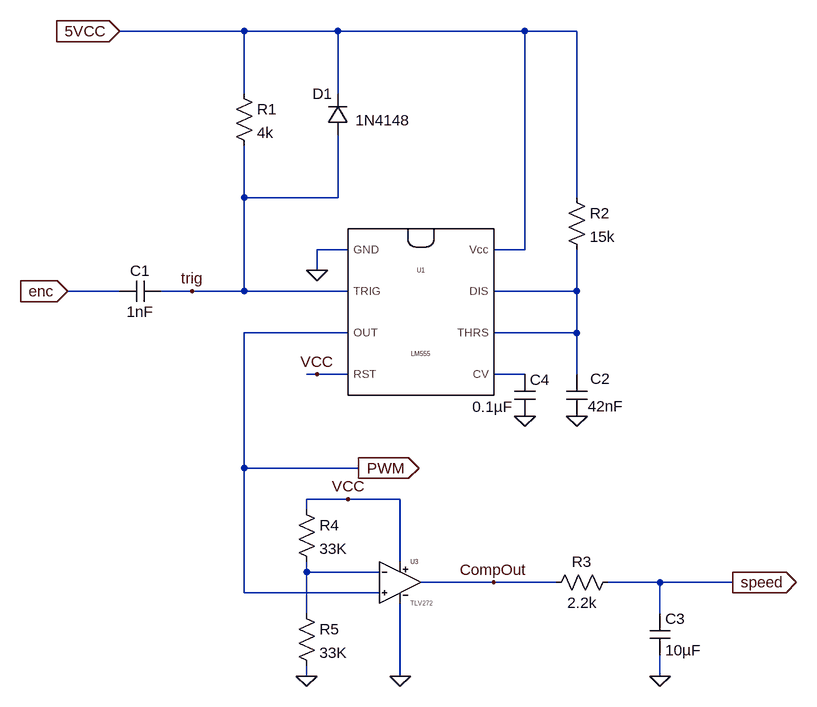
[diagram p0: schematic speedsense.asc]
speedsense.asc, the LTspice schematic file:
Version 4
SHEET 1 1592 1060
WIRE 704 -32 512 -32
WIRE 848 -32 704 -32
WIRE 1136 -32 848 -32
WIRE 1216 -32 1136 -32
WIRE 704 64 704 -32
WIRE 848 64 848 -32
WIRE 704 224 704 144
WIRE 848 224 848 128
WIRE 848 224 704 224
WIRE 1216 224 1216 -32
WIRE 864 304 816 304
WIRE 1136 304 1136 -32
WIRE 1136 304 1088 304
WIRE 816 336 816 304
WIRE 512 368 432 368
WIRE 624 368 576 368
WIRE 704 368 704 224
WIRE 704 368 624 368
WIRE 864 368 704 368
WIRE 1216 368 1216 304
WIRE 1216 368 1088 368
WIRE 864 432 704 432
WIRE 1216 432 1216 368
WIRE 1216 432 1088 432
WIRE 816 496 800 496
WIRE 864 496 816 496
WIRE 1136 496 1088 496
WIRE 1216 496 1216 432
WIRE 704 640 704 432
WIRE 880 640 704 640
WIRE 864 688 800 688
WIRE 944 688 864 688
WIRE 800 704 800 688
WIRE 944 784 944 688
WIRE 800 800 800 784
WIRE 912 800 800 800
WIRE 1088 816 976 816
WIRE 1184 816 1088 816
WIRE 1344 816 1264 816
WIRE 1456 816 1344 816
WIRE 704 832 704 640
WIRE 912 832 704 832
WIRE 800 864 800 800
WIRE 1344 864 1344 816
WIRE 800 960 800 944
WIRE 944 960 944 848
WIRE 1344 960 1344 928
FLAG 816 336 0
FLAG 1216 560 0
FLAG 1136 560 0
FLAG 1344 960 0
FLAG 512 -32 5VCC
IOPIN 512 -32 In
FLAG 816 496 VCC
FLAG 880 640 PWM
IOPIN 880 640 Out
FLAG 1456 816 speed
IOPIN 1456 816 Out
FLAG 432 368 enc
IOPIN 432 368 In
FLAG 624 368 trig
FLAG 800 960 0
FLAG 944 960 0
FLAG 864 688 VCC
FLAG 1088 816 CompOut
SYMBOL res 688 48 R0
SYMATTR InstName R1
SYMATTR Value 4k
SYMBOL diode 864 128 R180
WINDOW 0 24 64 Left 2
WINDOW 3 -96 23 Left 2
SYMATTR InstName D1
SYMATTR Value 1N4148
SYMBOL LM555 976 400 R0
SYMATTR InstName U1
SYMBOL res 1200 208 R0
SYMATTR InstName R2
SYMATTR Value 15k
SYMBOL cap 1120 496 R0
WINDOW 3 -65 50 Left 2
SYMATTR Value 0.1µF
SYMATTR InstName C4
SYMBOL res 1168 832 R270
WINDOW 0 32 56 VTop 2
WINDOW 3 0 56 VBottom 2
SYMATTR InstName R3
SYMATTR Value 2.2k
SYMBOL cap 1328 864 R0
SYMATTR InstName C3
SYMATTR Value 10µF
SYMBOL cap 512 384 R270
WINDOW 0 32 32 VTop 2
WINDOW 3 0 32 VBottom 2
SYMATTR InstName C1
SYMATTR Value 1nF
SYMBOL cap 1200 496 R0
WINDOW 0 37 7 Left 2
WINDOW 3 33 49 Left 2
SYMATTR InstName C2
SYMATTR Value 42nF
SYMBOL res 784 688 R0
SYMATTR InstName R4
SYMATTR Value 33K
SYMBOL res 784 848 R0
SYMATTR InstName R5
SYMATTR Value 33K
SYMBOL TL272 944 816 R0
SYMATTR InstName U3

The netlist it stands for:
* speedsense.asc
R1 5VCC trig 4k
D1 trig 5VCC 1N4148
XU1 0 trig PWM VCC N002 N001 N001 5VCC NE555  ; pins GND TRIG OUT RST CV THRS DIS Vcc
R2 5VCC N001 15k
C4 N002 0 0.1µF
R3 CompOut speed 2.2k
C3 speed 0 10µF
C1 enc trig 1nF
C2 N001 0 42nF
R4 VCC N003 33K
R5 N003 0 33K
XU3 PWM N003 VCC 0 CompOut level.2 Avol=1Meg GBW=3Meg Slew=2.4Meg ilimit=20m rail=0.1 Vos=0 phimargin=45 en=0 enk=0 in=0 ink=0 Rin=500Meg  ; pins In+ In- V+ V- OUT
.model D D
.lib standard.dio
.lib NE555.sub
.lib UniversalOpamps2.sub
.backanno
.end